# EasyEDA schematic SCH_Claysight-MK2.json
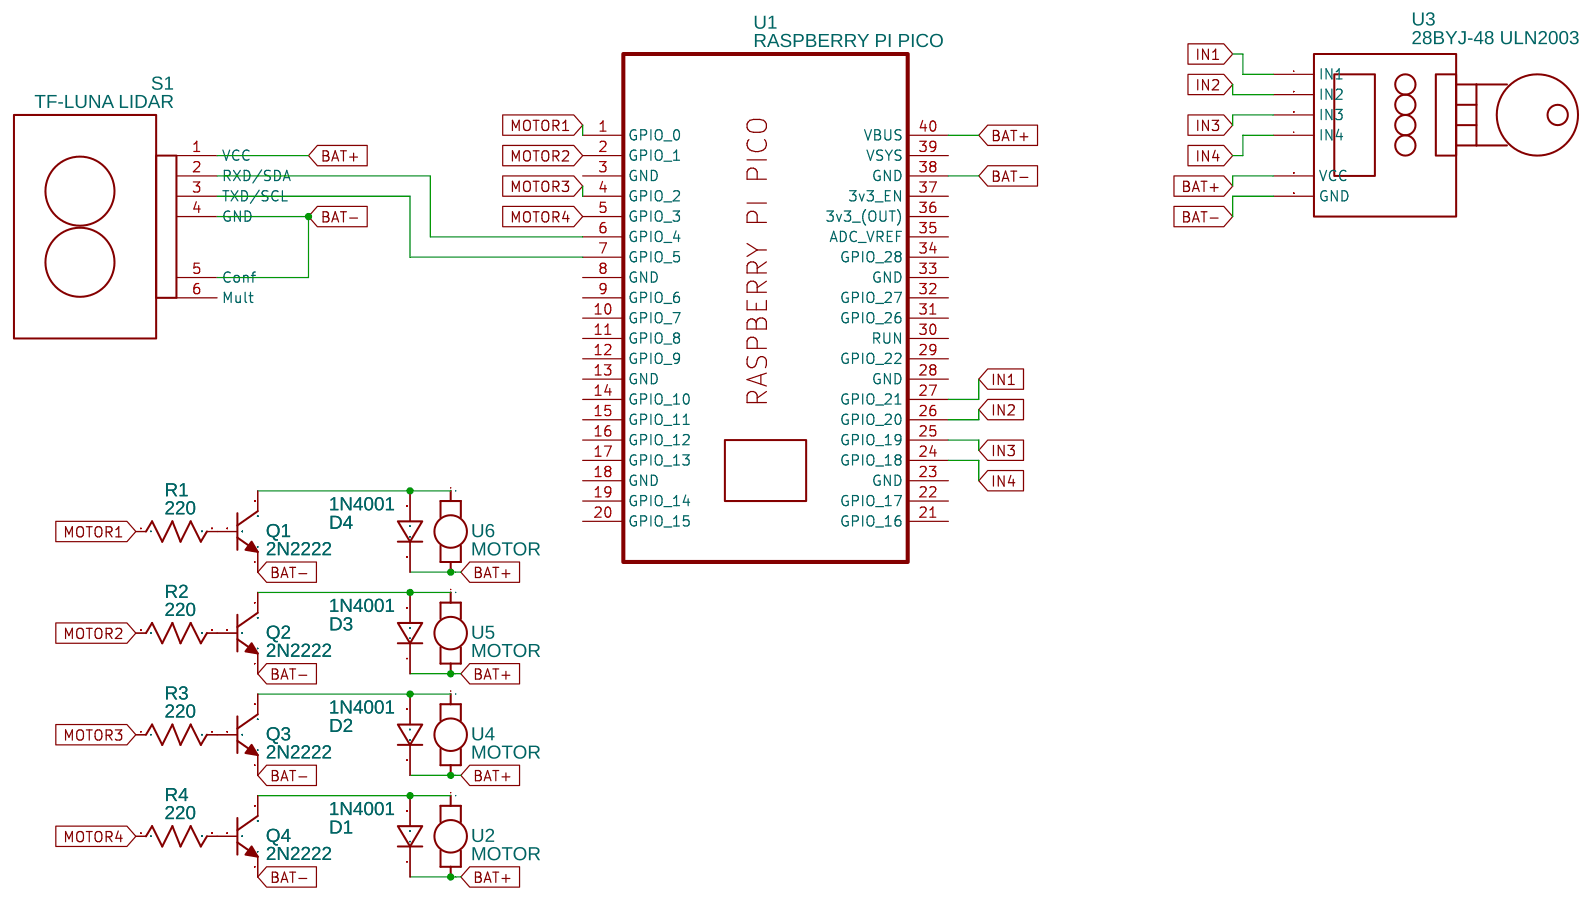
[diagram p0: schematic sheet]

## Parts
D1  1N4001  [SOD-123_L2.8-W1.8-LS3.7-RD]
D2  1N4001  [SOD-123_L2.8-W1.8-LS3.7-RD]
D3  1N4001  [SOD-123_L2.8-W1.8-LS3.7-RD]
D4  1N4001  [SOD-123_L2.8-W1.8-LS3.7-RD]
Q1  2N2222  [SOT-23-3_L2.9-W1.3-P1.90-LS2.4-TR]
Q2  2N2222  [SOT-23-3_L2.9-W1.3-P1.90-LS2.4-TR]
Q3  2N2222  [SOT-23-3_L2.9-W1.3-P1.90-LS2.4-TR]
Q4  2N2222  [SOT-23-3_L2.9-W1.3-P1.90-LS2.4-TR]
R1  220  [R0603]
R2  220  [R0603]
R3  220  [R0603]
R4  220  [R0603]
S1  TF-LUNA LIDAR  [TF_LUNA]
U1  RASPBERRY PI PICO  [RASPBERRY PI PICO/ RASPBERRY PI PICO W]
U2  MOTOR  [VIBE-MOTOR-10MM]
U3  28BYJ-48 ULN2003  [28BYJ-48 ULN2003]
U4  MOTOR  [VIBE-MOTOR-10MM]
U5  MOTOR  [VIBE-MOTOR-10MM]
U6  MOTOR  [VIBE-MOTOR-10MM]

## Library data of the parts
D1-D4 = 1N4007W: Supplier: LCSC; Supplier Part: C328592; Manufacturer: BLUE ROCKET; Contributor: LCEDA_Lib
Q1-Q4 = 2N3904(SOT-23): Supplier: LCSC; Manufacturer: KEC; Manufacturer Part: 2n3904S-RTK/PS; Supplier Part: C18536; Paste Type: SOT-23; Contributor: LCEDA_Lib
R1-R4 = R_0603_US: Contributor: LCEDA_Lib
S1 = TF-LUNA: Manufacturer: Benewake; Supplier: Benewake; Contributor: Dmitry Mazur
U1 = Raspberry Pi Pico W: Contributor: houston1
U2 U4-U6 = MOTOR: Contributor: SparkFun
U3 = 28BYJ-48 ULN2003: Supplier: eBay; Contributor: gagagu1

## Nets
BAT+: D1.1 D2.1 D3.1 D4.1 U1.40(VBUS) U2.- U3.5(VCC) U4.- U5.- U6.-
BAT-: Q1.1(E) Q2.1(E) Q3.1(E) Q4.1(E) U1.38(GND) U3.6(GND)
IN1: U1.27(GPIO 21) U3.1(IN1)
IN2: U1.26(GPIO 20) U3.2(IN2)
IN3: U1.25(GPIO 19) U3.3(IN3)
IN4: U1.24(GPIO 18) U3.4(IN4)
MOTOR1: R1.1 U1.1(GPIO 0)
MOTOR2: R2.1 U1.2(GPIO 1)
MOTOR3: R3.1 U1.4(GPIO 2)
MOTOR4: R4.1 U1.5(GPIO 3)
Net-(D1-2): D1.2 Q4.3(C) U2.+
Net-(D2-2): D2.2 Q3.3(C) U4.+
Net-(D3-2): D3.2 Q2.3(C) U5.+
Net-(D4-2): D4.2 Q1.3(C) U6.+
Net-(Q1-2): Q1.2(B) R1.2
Net-(Q2-2): Q2.2(B) R2.2
Net-(Q3-2): Q3.2(B) R3.2
Net-(Q4-2): Q4.2(B) R4.2

Not connected (* = marked no-connect by the designer): S1 1(VCC) 2(RXD/SDA) 3(TXD/SCL) 4(GND) 5(Conf) 6(Mult); U1 3(GND) 6(GPIO 4) 7(GPIO 5) 8(GND) 9(GPIO 6) 10(GPIO 7) 11(GPIO 8) 12(GPIO 9) 13(GND) 14(GPIO 10) 15(GPIO 11) 16(GPIO 12) 17(GPIO 13) 18(GND) 19(GPIO 14) 20(GPIO 15) 21(GPIO 16) 22(GPIO 17) 23(GND) 28(GND) 29(GPIO 22) 30(RUN) 31(GPIO 26) 32(GPIO 27) 33(GND) 34(GPIO 28) 35(ADC_VREF) 36(3v3 (OUT)) 37(3v3_EN) 39(VSYS)
